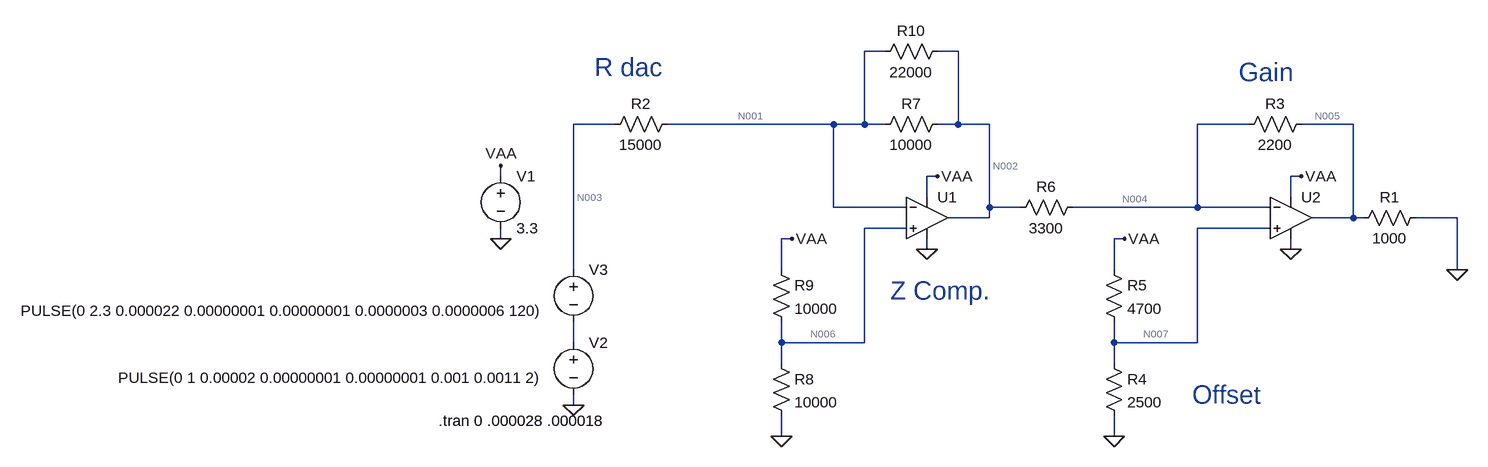
[diagram p0: schematic basic.asc]
basic.asc, the LTspice schematic file:
Version 4
SHEET 1 1588 680
WIRE 304 -80 272 -80
WIRE 416 -80 384 -80
WIRE -112 32 -176 32
WIRE 224 32 -32 32
WIRE 272 32 272 -80
WIRE 272 32 224 32
WIRE 304 32 272 32
WIRE 416 32 416 -80
WIRE 416 32 384 32
WIRE 464 32 416 32
WIRE 864 32 784 32
WIRE 1024 32 944 32
WIRE -288 112 -288 96
WIRE 384 112 368 112
WIRE 944 112 928 112
WIRE 368 144 368 112
WIRE 928 144 928 112
WIRE 224 160 224 32
WIRE 336 160 224 160
WIRE 464 160 464 32
WIRE 512 160 464 160
WIRE 784 160 784 32
WIRE 784 160 592 160
WIRE 896 160 784 160
WIRE 464 176 464 160
WIRE 464 176 400 176
WIRE 1024 176 1024 32
WIRE 1024 176 960 176
WIRE 1040 176 1024 176
WIRE 1184 176 1120 176
WIRE 336 192 272 192
WIRE 896 192 784 192
WIRE -288 208 -288 192
WIRE 160 208 144 208
WIRE 672 208 656 208
WIRE 368 224 368 208
WIRE 928 224 928 208
WIRE -176 256 -176 32
WIRE 144 256 144 208
WIRE 656 256 656 208
WIRE 1184 256 1184 176
WIRE -176 368 -176 336
WIRE 144 368 144 336
WIRE 272 368 272 192
WIRE 272 368 144 368
WIRE 656 368 656 336
WIRE 784 368 784 192
WIRE 784 368 656 368
WIRE 144 400 144 368
WIRE 656 400 656 368
WIRE -176 464 -176 448
WIRE 144 512 144 480
WIRE 656 512 656 480
FLAG -288 208 0
FLAG -176 464 0
FLAG 928 224 0
FLAG 944 112 VAA
FLAG -288 96 VAA
FLAG 1184 256 0
FLAG 368 224 0
FLAG 384 112 VAA
FLAG 144 512 0
FLAG 160 208 VAA
FLAG 656 512 0
FLAG 672 208 VAA
SYMBOL voltage -288 96 R0
WINDOW 123 0 0 Left 0
WINDOW 39 0 0 Left 0
SYMATTR InstName V1
SYMATTR Value 3.3
SYMBOL voltage -176 352 R0
WINDOW 3 -39 70 Right 2
WINDOW 123 0 0 Left 0
WINDOW 39 0 0 Left 0
SYMATTR Value PULSE(0 1 0.00002 0.00000001 0.00000001 0.001 0.0011 2)
SYMATTR InstName V2
SYMBOL res 1136 160 R90
WINDOW 0 0 56 VBottom 2
WINDOW 3 32 56 VTop 2
SYMATTR InstName R1
SYMATTR Value 1000
SYMBOL voltage -176 240 R0
WINDOW 3 -34 79 Right 2
WINDOW 123 0 0 Left 0
WINDOW 39 0 0 Left 0
SYMATTR Value PULSE(0 2.3 0.000022 0.00000001 0.00000001 0.0000003 0.0000006 120)
SYMATTR InstName V3
SYMBOL Opamps\\UniversalOpamp2 928 176 R0
SYMATTR InstName U2
SYMATTR Value2 Avol=1Meg GBW=20Meg Slew=20Meg
SYMBOL res -16 16 R90
WINDOW 0 0 56 VBottom 2
WINDOW 3 32 56 VTop 2
SYMATTR InstName R2
SYMATTR Value 15000
SYMBOL res 960 16 R90
WINDOW 0 0 56 VBottom 2
WINDOW 3 32 56 VTop 2
SYMATTR InstName R3
SYMATTR Value 2200
SYMBOL res 608 144 R90
WINDOW 0 0 56 VBottom 2
WINDOW 3 32 56 VTop 2
SYMATTR InstName R6
SYMATTR Value 3300
SYMBOL Opamps\\UniversalOpamp2 368 176 R0
SYMATTR InstName U1
SYMATTR Value2 Avol=1Meg GBW=20Meg Slew=20Meg
SYMBOL res 400 16 R90
WINDOW 0 0 56 VBottom 2
WINDOW 3 32 56 VTop 2
SYMATTR InstName R7
SYMATTR Value 10000
SYMBOL res 128 384 R0
SYMATTR InstName R8
SYMATTR Value 10000
SYMBOL res 128 240 R0
SYMATTR InstName R9
SYMATTR Value 10000
SYMBOL res 640 384 R0
SYMATTR InstName R4
SYMATTR Value 2500
SYMBOL res 640 240 R0
SYMATTR InstName R5
SYMATTR Value 4700
SYMBOL res 288 -64 R270
WINDOW 0 32 56 VTop 2
WINDOW 3 0 56 VBottom 2
SYMATTR InstName R10
SYMATTR Value 22000
TEXT -384 488 Left 2 !.tran 0 .000028 .000018
TEXT 776 448 Left 4 ;Offset
TEXT 848 -48 Left 4 ;Gain
TEXT 312 288 Left 4 ;Z Comp.
TEXT -144 -56 Left 4 ;R dac

The netlist it stands for:
* basic.asc
V1 VAA 0 3.3
V2 N008 0 PULSE(0 1 0.00002 0.00000001 0.00000001 0.001 0.0011 2)
R1 0 N005 1000
V3 N003 N008 PULSE(0 2.3 0.000022 0.00000001 0.00000001 0.0000003 0.0000006 120)
XU2 N007 N004 VAA 0 N005 level.2 Avol=1Meg GBW=20Meg Slew=20Meg ilimit=25m rail=0 Vos=0 phimargin=45 en=0 enk=0 in=0 ink=0 Rin=500Meg  ; pins IN+ IN- V+ V- OUT
R2 N001 N003 15000
R3 N005 N004 2200
R6 N004 N002 3300
XU1 N006 N001 VAA 0 N002 level.2 Avol=1Meg GBW=20Meg Slew=20Meg ilimit=25m rail=0 Vos=0 phimargin=45 en=0 enk=0 in=0 ink=0 Rin=500Meg  ; pins IN+ IN- V+ V- OUT
R7 N002 N001 10000
R8 N006 0 10000
R9 VAA N006 10000
R4 N007 0 2500
R5 VAA N007 4700
R10 N001 N002 22000
.tran 0 .000028 .000018
* Offset
* Gain
* Z Comp.
* R dac
.lib UniversalOpamps2.sub
.backanno
.end

* Results of the author's LTspice run, read from the files saved beside the schematic
* Operating Point, zero values left out:
*   V(vaa) = 3.3 V
*   V(n005) = 305.6 mV
*   V(n004) = 1.146 V
*   V(n007) = 1.146 V
*   V(n001) = 1.65 V
*   V(n002) = 2.406 V
*   V(n006) = 1.65 V
*   I(R10) = -34.37 µA
*   I(R5) = 458.3 µA
*   I(R4) = 458.3 µA
*   I(R9) = 165 µA
*   I(R8) = 165 µA
*   I(R7) = 75.62 µA
*   I(R6) = -381.9 µA
*   I(R3) = -381.9 µA
*   I(R2) = 110 µA
*   I(R1) = -305.6 µA
*   I(V3) = 110 µA
*   I(V2) = 110 µA
*   I(V1) = -1.221 mA
*   Ix(u2:1) = -1.008 nA
*   Ix(u2:2) = -1.008 nA
*   Ix(u2:3) = 64.82 µA
*   Ix(u2:4) = -141.2 µA
*   Ix(u2:5) = 76.39 µA
*   Ix(u1:3) = 532.3 µA
*   Ix(u1:4) = -40.41 µA
*   Ix(u1:5) = -491.9 µA
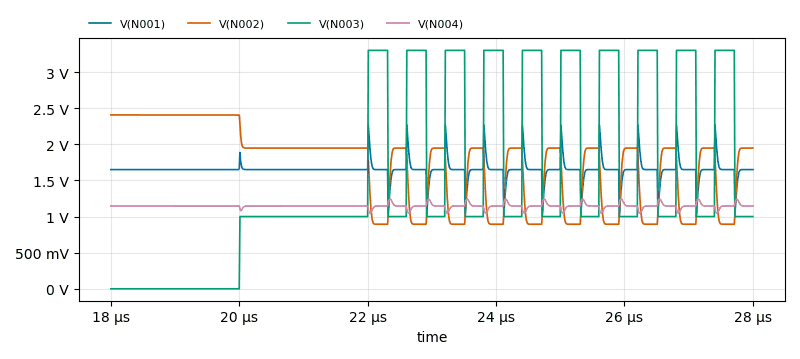
[diagram p1: Transient Analysis of basic.asc, plotted from the saved traces]
* Transient Analysis, 1 run:
*   V(N001): min 1.031 V, max 2.268 V, average 1.65 V, rms 1.655 V, last 1.65 V
*   V(N002): min 893.7 mV, max 2.406 V, average 1.714 V, rms 1.801 V, last 1.948 V
*   V(N003): min 0 V, max 3.3 V, average 1.512 V, rms 1.962 V, last 1 V
*   V(N004): min 1.048 V, max 1.242 V, average 1.145 V, rms 1.146 V, last 1.146 V